# Altium schematic sheet sheet1.SchDoc
size A4
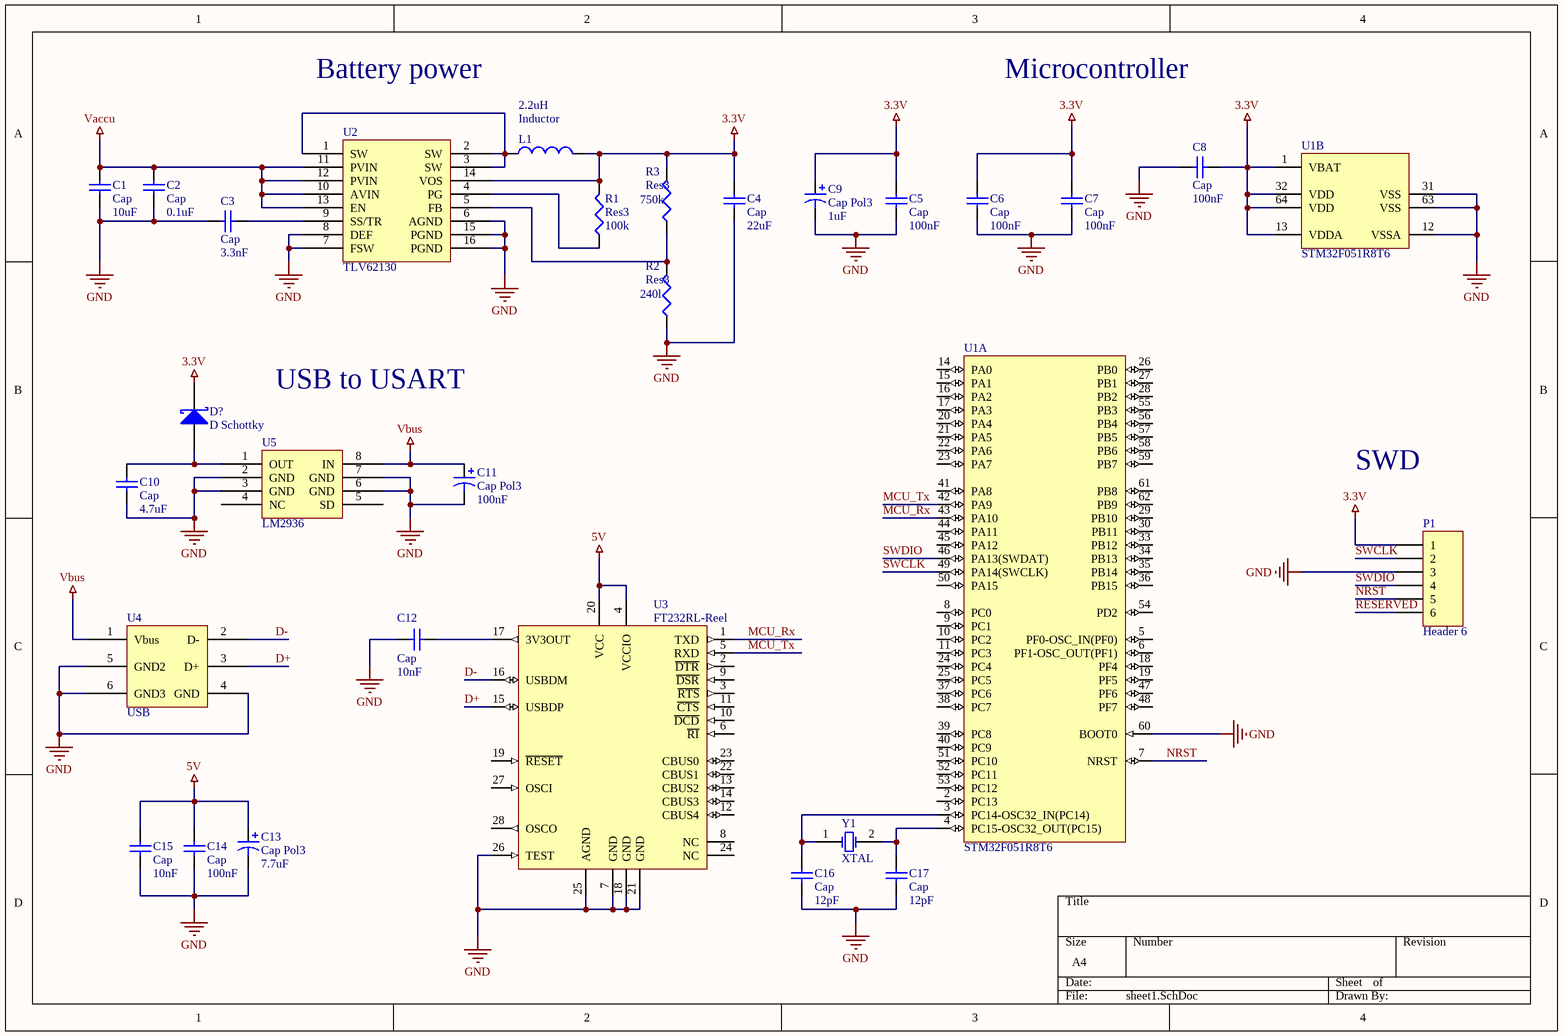
[diagram p0: sheet1.SchDoc]

## Parts
C1  Cap  value 10uF  [C0805]
C2  Cap  value 0.1uF  [C0805]
C3  Cap  value 3.3nF  [C0805]
C4  Cap  value 22uF  [C0805]
C5  Cap  value 100nF  [RAD-0.3]
C6  Cap  value 100nF  [RAD-0.3]
C7  Cap  value 100nF  [RAD-0.3]
C8  Cap  value 100nF  [C0805]
C9  Cap Pol3  value 1uF  [C0805]
C10  Cap  value 4.7uF  [C0805]
C11  Cap Pol3  value 100nF  [C0805]
C12  Cap  value 10nF  [C0805]
C13  Cap Pol3  value 7.7uF  [C0805]
C14  Cap  value 100nF  [C0805]
C15  Cap  value 10nF  [C0805]
C16  Cap  value 12pF  [C0805]
C17  Cap  value 12pF  [C0805]
D?  D Schottky  [SMB]
L1  Inductor  value 2.2uH  [INDC4532]
P1  Header 6  [HDR1X6]
R1  Res3  value 100k  [J1-0603]
R2  Res3  value 240l  [J1-0603]
R3  Res3  value 750k  [J1-0603]
U1  STM32F051R8T6  [STM-LQFP64_N]  (parts A,B of 2)
U2  TLV62130  [QFN50P350X350X100-17N]
U3  FT232RL-Reel  [SSOP-28_N]
U4  USB
U5  LM2936
Y1  XTAL  [R38]

## Nets
3.3V: C4.2 C5.2 C6.2 C7.2 C8.2 C9.1 D?.2(K) L1.2 P1.1 R1.2 R3.2 U1.1(VBAT) U1.13(VDDA) U1.32(VDD) U1.64(VDD) U2.14(VOS)
5V: C13.1 C14.2 C15.2 U3.4(VCCIO) U3.20(VCC)
GND: C1.1 C2.2 C3.1 C4.1 C5.1 C6.1 C7.1 C8.1 C9.2 C10.1 C11.2 C12.2 C13.2 C14.1 C15.1 C16.1 C17.1 P1.3 R2.1 U1.12(VSSA) U1.31(VSS) U1.60(BOOT0) U1.63(VSS) U2.6(AGND) U2.7(FSW) U2.8(DEF) U2.15(PGND) U2.16(PGND) U3.7(GND) U3.18(GND) U3.21(GND) U3.25(AGND) U3.26(TEST) U4.4(GND) U4.5(GND2) U4.6(GND3) U5.2(GND) U5.3(GND) U5.6(GND) U5.7(GND)
Vaccu: C1.2 C2.1 U2.10(AVIN) U2.11(PVIN) U2.12(PVIN) U2.13(EN)
Vbus: C11.1 U4.1(Vbus) U5.8(IN)
D+: U3.15(USBDP) U4.3(D+)
D-: U3.16(USBDM) U4.2(D-)
MCU_Rx: U1.43(PA10) U3.1(TXD)
MCU_Tx: U1.42(PA9) U3.5(RXD)
NRST: P1.5 U1.7(NRST)
RESERVED: P1.6
SWCLK: P1.2 U1.49(PA14(SWCLK))
SWDIO: P1.4 U1.46(PA13(SWDAT))
NetC3_2: C3.2 U2.9(SS/TR)
NetC10_2: C10.2 D?.1(A) U5.1(OUT)
NetC12_1: C12.1 U3.17(3V3OUT)
NetC16_2: C16.2 U1.3(PC14-OSC32_IN(PC14)) Y1.1(OSC1)
NetC17_2: C17.2 U1.4(PC15-OSC32_OUT(PC15)) Y1.2(OSC2)
NetL1_1: L1.1 U2.1(SW) U2.2(SW) U2.3(SW)
NetR1_1: R1.1 U2.4(PG)
NetR2_2: R2.2 R3.1 U2.5(FB)

Not connected (* = marked no-connect by the designer): U1 2(PC13) 5(PF0-OSC_IN(PF0)) 6(PF1-OSC_OUT(PF1)) 8(PC0) 9(PC1) 10(PC2) 11(PC3) 14(PA0) 15(PA1) 16(PA2) 17(PA3) 18(PF4) 19(PF5) 20(PA4) 21(PA5) 22(PA6) 23(PA7) 24(PC4) 25(PC5) 26(PB0) 27(PB1) 28(PB2) 29(PB10) 30(PB11) 33(PB12) 34(PB13) 35(PB14) 36(PB15) 37(PC6) 38(PC7) 39(PC8) 40(PC9) 41(PA8) 44(PA11) 45(PA12) 47(PF6) 48(PF7) 50(PA15) 51(PC10) 52(PC11) 53(PC12) 54(PD2) 55(PB3) 56(PB4) 57(PB5) 58(PB6) 59(PB7) 61(PB8) 62(PB9); U3 2(~{DTR}) 3(~{RTS}) 6(~{RI}) 8(NC) 9(~{DSR}) 10(~{DCD}) 11(~{CTS}) 12(CBUS4) 13(CBUS2) 14(CBUS3) 19(~{RESET}) 22(CBUS1) 23(CBUS0) 24(NC) 27(OSCI) 28(OSCO); U5 4(NC) 5(SD)

## Notes on the sheet
- Battery power
- Microcontroller
- USB to USART
- SWD

## Library data of the parts
C1-C8 C10 C12 C14-C17 = Cap: Capacitor; Published: 8-Jun-2000; LatestRevisionDate: 17-Jul-2002; LatestRevisionNote: Re-released for DXP Platform.; PackageReference: RAD-0.3; Publisher: Altium Limited; PackageDescription: Radial Cap, Thru-Hole; 2 Leads; 0.3 in Pin Spacing
C9 C11 C13 = Cap Pol3: Polarized Capacitor (Surface Mount); Published: 8-Jun-2000; LatestRevisionDate: 29-May-2009; LatestRevisionNote: IPC-7351 Footprint Added.; PackageReference: C0805; Publisher: Altium Limited; PackageDescription: Chip Capacitor
D? = D Schottky: Schottky Diode; Published: 8-Jun-2000; LatestRevisionDate: 17-Jul-2002; LatestRevisionNote: Re-released for DXP Platform.; PackageReference: SMB; Publisher: Altium Limited; PackageDescription: DO-214-AA/SMB; 2 C-Bend Leads; Body 5.3 x 3.6 mm, inc. leads (LxW); Code_JEDEC: DO-214-AA
L1 = Inductor: Code_IEC: 1005; Published: 8-Jun-2000; LatestRevisionDate: 29-May-2009; LatestRevisionNote: IPC-7351 Footprint Added.; PackageReference: 0402-A; Publisher: Altium Limited; PackageDescription: Chip Inductor; Code_JEITA: 0402
P1 = Header 6: Header, 6-Pin; LatestRevisionDate: 17-Jul-2002; LatestRevisionNote: Re-released for DXP Platform.; Publisher: Altium Limited
R1-R3 = Res3: Resistor; Published: 8-Jun-2000; LatestRevisionDate: 29-May-2009; LatestRevisionNote: IPC-7351 Footprint Added.; PackageReference: J1-0603; Publisher: Altium Limited; PackageDescription: Chip Resistor
U1 = STM32F051R8T6: ARM Cortex-M0 32-bit MCU, 64 KB Flash, 8 KB Internal RAM, 55 I/Os, 64-pin LQFP, -40 to 85 degC, Tray; FLASH Size (Prog) (kB): 64; I/Os (High Current): 55; Internal RAM Size (kB): 8; Operating Frequency(F) (Processor speed) (MHz): 48; Supply Voltage(Vcc) min (V): 2; DatasheetVersion: Rev. 3; PackageVersion: Rev. 4, 06/2013; PackageReference: LQFP64; PackageDescription: 64-Pin Low Profile Quad Flat Package, 10 x 10 mm Body, 0.5 mm Pitch; Supplier 1: Digi-Key; Supplier Part Number 1: 497-12891-ND; Supplier 2: Farnell; Supplier Part Number 2: 2115071; Supplier 3: Newark; Supplier Part Number 3: 05W5808; Supplier 4: Mouser; Supplier Part Number 4: 511-STM32F051R8T6; Core: ARM Cortex-M0; Packing: Tray; Mounting Technology: Surface Mount; PartNumber: STM32F051R8T6; ComponentLink1Description: Manufacturer URL; ComponentLink1URL: http://www.st.com/web/en/home.html; ComponentLink2Description: Datasheet; ComponentLink2URL: http://www.st.com/st-web-ui/static/active/en/resource/technical/document/datasheet/DM00039193.pdf; ComponentLink3Description: Package Specification; ComponentLink3URL: http://www.st.com/st-web-ui/static/active/en/resource/technical/document/datasheet/DM00037051.pdf
U3 = FT232RL-Reel: USB UART Asynchronous Serial Data Transfer Chip, 28-pin SSOP, Tape and Reel; Manufacturer: FTDI; DatasheetVersion: ver 2.10, Mar-2012; PackageVersion: Mar-12; PackageReference: SSOP-28; PackageDescription: 28-Pin Small Outline Package 0.65 mm Pitch; PartNumber: FT232RL-Reel; ComponentLink1Description: Manufacturer URL; ComponentLink1URL: http://www.ftdichip.com/; ComponentLink2Description: Datasheet; ComponentLink2URL: http://www.ftdichip.com/Support/Documents/DataSheets/ICs/DS_FT232R.pdf
U4 = Component_1
Y1 = XTAL: Crystal Oscillator; Published: 8-Jun-2000; LatestRevisionDate: 17-Jul-2002; LatestRevisionNote: Re-released for DXP Platform.; PackageReference: R38; Publisher: Altium Limited; PackageDescription: Crystal, Thru-Hole; 2 Leads; Body 3.1 x 8.2 mm (Dia.xH)